# Altium schematic sheet 电源.SchDoc
size A3
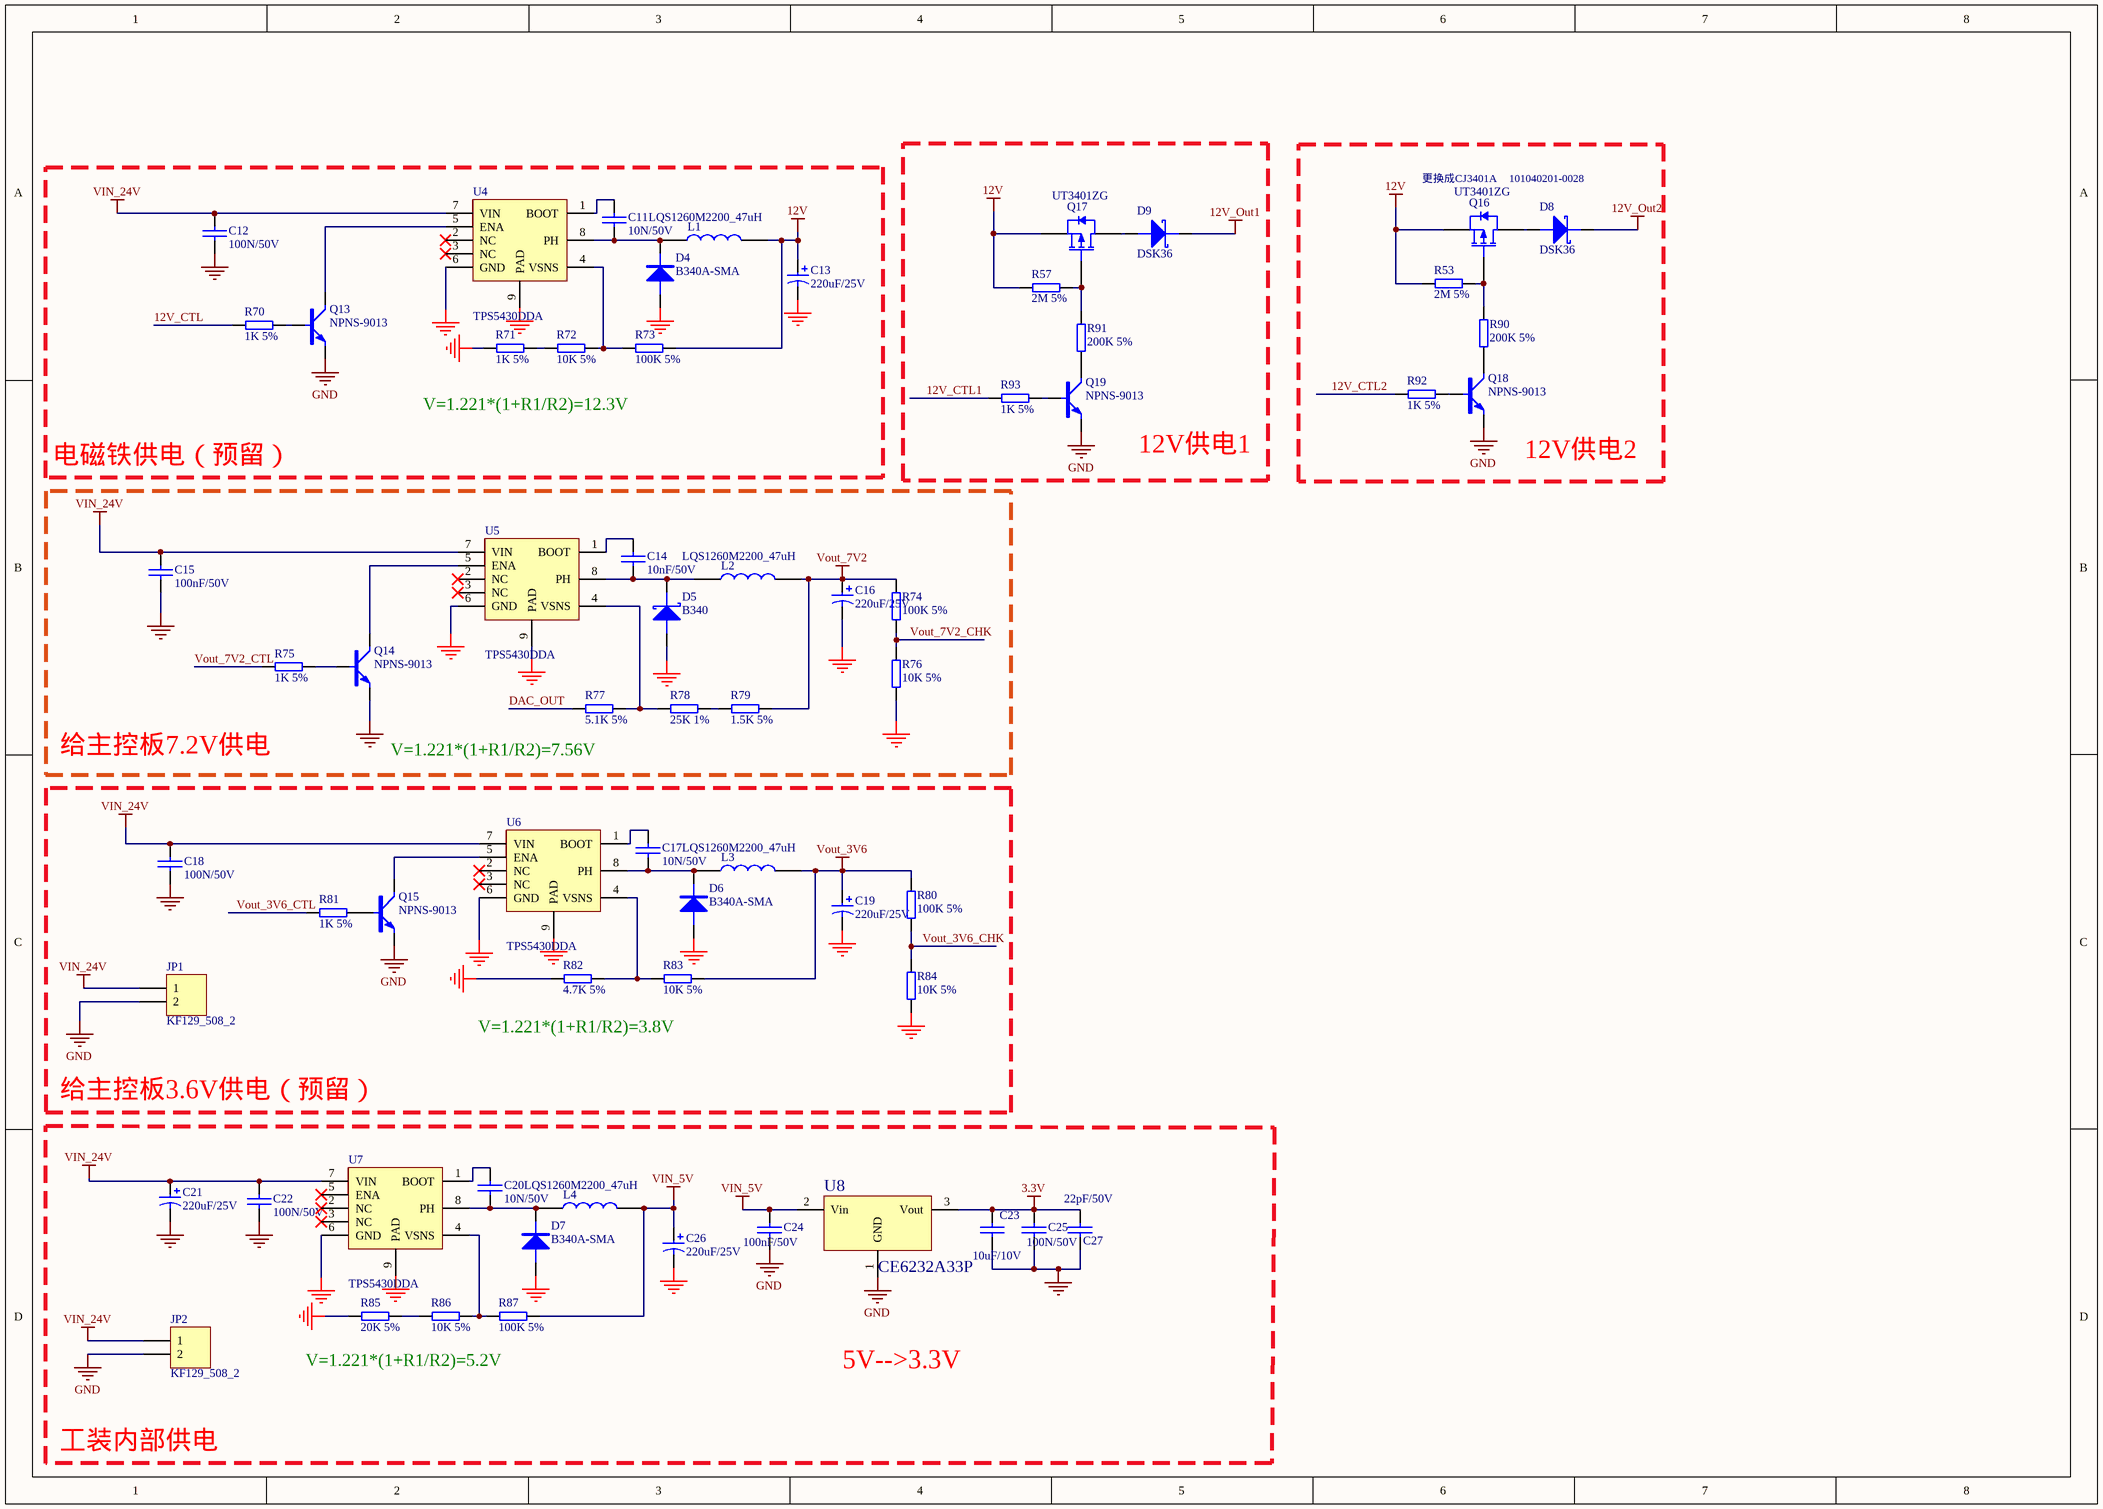
[diagram p0: 电源.SchDoc]

## Parts
C11  10N/50V  [CAP0603]
C12  100N/50V  [CAP0603]
C13  220uF/25V  [220uF 25V]
C14  10nF/50V  [CAP0603]
C15  100nF/50V  [CAP0603]
C16  220uF/25V  [220uF 25V]
C17  10N/50V  [CAP0603]
C18  100N/50V  [CAP0603]
C19  220uF/25V  [220uF 25V]
C20  10N/50V  [CAP0603]
C21  220uF/25V  [220uF 25V]
C22  100N/50V  [CAP0603]
C23  10uF/10V  [CAP0603]
C24  100nF/50V  [CAP0603]
C25  100N/50V  [CAP0603]
C26  220uF/25V  [220uF 25V]
C27  22pF/50V  [CAP0603]
D4  B340A-SMA  [DO-214AC]
D5  B340  [DO-214AC]
D6  B340A-SMA  [DO-214AC]
D7  B340A-SMA  [DO-214AC]
D8  DSK36  [SOD-123FL]
D9  DSK36  [SOD-123FL]
JP1  KF129_508_2  [KF129_508_2]
JP2  KF129_508_2  [KF129_508_2]
L1  LQS1260M2200_47uH  [LQS1212]
L2  LQS1260M2200_47uH  [LQS1212]
L3  LQS1260M2200_47uH  [LQS1212]
L4  LQS1260M2200_47uH  [LQS1212]
Q13  NPNS-9013  [SOT-23]
Q14  NPNS-9013  [SOT-23]
Q15  NPNS-9013  [SOT-23]
Q16  UT3401ZG  [SOT-23]
Q17  UT3401ZG  [SOT-23]
Q18  NPNS-9013  [SOT-23]
Q19  NPNS-9013  [SOT-23]
R53  2M 5%  [RES0603]
R57  2M 5%  [RES0603]
R70  1K 5%  [RES0603]
R71  1K 5%  [RES0603]
R72  10K 5%  [RES0603]
R73  100K 5%  [RES0603]
R74  100K 5%  [RES0603]
R75  1K 5%  [RES0603]
R76  10K 5%  [RES0603]
R77  5.1K 5%  [RES0603]
R78  25K 1%  [RES0603]
R79  1.5K 5%  [RES0603]
R80  100K 5%  [RES0603]
R81  1K 5%  [RES0603]
R82  4.7K 5%  [RES0603]
R83  10K 5%  [RES0603]
R84  10K 5%  [RES0603]
R85  20K 5%  [RES0603]
R86  10K 5%  [RES0603]
R87  100K 5%  [RES0603]
R90  200K 5%  [RES0603]
R91  200K 5%  [RES0603]
R92  1K 5%  [RES0603]
R93  1K 5%  [RES0603]
U4  TPS5430DDA  [SOP-8-P]
U5  TPS5430DDA  [SOP-8-P]
U6  TPS5430DDA  [SOP-8-P]
U7  TPS5430DDA  [SOP-8-P]
U8  CE6232A33P  [SOT-89]

## Blocks framed on the sheet
电磁铁供电（预留）: C11-C13 D4 L1 Q13 R70-R73 U4
12V供电1: D9 Q17 Q19 R57 R91 R93
12V供电2: D8 Q16 Q18 R53 R90 R92
给主控板7.2V供电: C14-C16 D5 L2 Q14 R74-R79 U5
给主控板3.6V供电（预留）: C17-C19 D6 JP1 L3 Q15 R80-R84 U6

## Nets
3.3V: C23.1 C25.1 C27.1 U8.3(Vout)
12V: C13.1 L1.2 Q16.2(S) Q17.2(S) R53.1 R57.1 R73.2
12V_Out1: D9.2
12V_Out2: D8.2
GND: C12.2 C13.2 C15.2 C16.2 C18.2 C19.2 C21.2 C22.2 C23.2 C24.2 C25.2 C26.2 C27.2 D4.1 D5.1 D6.1 D7.1 JP1.2 JP2.2 Q13.2(E) Q14.2(E) Q15.2(E) Q18.2(E) Q19.2(E) R71.1 R76.1 R82.1 R84.1 R85.1 U4.6(GND) U4.9(PAD) U5.6(GND) U5.9(PAD) U6.6(GND) U6.9(PAD) U7.6(GND) U7.9(PAD) U8.1(GND)
VIN_5V: C24.1 C26.1 L4.2 R87.1 U8.2(Vin)
VIN_24V: C12.1 C15.1 C18.1 C21.1 C22.1 JP1.1 JP2.1 U4.7(VIN) U5.7(VIN) U6.7(VIN) U7.7(VIN)
Vout_3V6: C19.1 L3.2 R80.2 R83.2
Vout_7V2: C16.1 L2.2 R74.2 R79.2
12V_CTL: R70.1
12V_CTL1: R93.1
12V_CTL2: R92.1
DAC_OUT: R77.1
Vout_3V6_CHK: R80.1 R84.2
Vout_3V6_CTL: R81.1
Vout_7V2_CHK: R74.1 R76.2
Vout_7V2_CTL: R75.1
NetC11_1: C11.1 D4.2 L1.1 U4.8(PH)
NetC11_2: C11.2 U4.1(BOOT)
NetC14_1: C14.1 D5.2 L2.1 U5.8(PH)
NetC14_2: C14.2 U5.1(BOOT)
NetC17_1: C17.1 D6.2 L3.1 U6.8(PH)
NetC17_2: C17.2 U6.1(BOOT)
NetC20_1: C20.1 D7.2 L4.1 U7.8(PH)
NetC20_2: C20.2 U7.1(BOOT)
NetD8_1: D8.1 Q16.3(D)
NetD9_1: D9.1 Q17.3(D)
NetQ13_1: Q13.1(B) R70.2
NetQ13_3: Q13.3(C) U4.5(ENA)
NetQ14_1: Q14.1(B) R75.2
NetQ14_3: Q14.3(C) U5.5(ENA)
NetQ15_1: Q15.1(B) R81.2
NetQ15_3: Q15.3(C) U6.5(ENA)
NetQ16_1: Q16.1(G) R53.2 R90.2
NetQ17_1: Q17.1(G) R57.2 R91.2
NetQ18_1: Q18.1(B) R92.2
NetQ18_3: Q18.3(C) R90.1
NetQ19_1: Q19.1(B) R93.2
NetQ19_3: Q19.3(C) R91.1
NetR71_2: R71.2 R72.1
NetR72_2: R72.2 R73.1 U4.4(VSNS)
NetR77_2: R77.2 R78.1 U5.4(VSNS)
NetR78_2: R78.2 R79.1
NetR82_2: R82.2 R83.1 U6.4(VSNS)
NetR85_2: R85.2 R86.1
NetR86_2: R86.2 R87.2 U7.4(VSNS)

Not connected (* = marked no-connect by the designer): U4 2(NC)* 3(NC)*; U5 2(NC)* 3(NC)*; U6 2(NC)* 3(NC)*; U7 2(NC)* 3(NC)* 5(ENA)*

## Notes on the sheet
- 更换成CJ3401A    101040201-0028
- V=1.221*(1+R1/R2)=12.3V
- (near R77) V=1.221*(1+R1/R2)=7.56V
- V=1.221*(1+R1/R2)=3.8V
- V=1.221*(1+R1/R2)=5.2V
- 5V-->3.3V
- 工装内部供电

## Library data of the parts
C11 C17 C20 = 101020103-0007: 10N/50V，±10%，0603; Part Name: 0603贴片电容; ID: 35; Part Number: 101020103-0007
C12 C18 C22 C25 = 101020103-0021: 100N/50V，±10%，0603; Part Name: 0603贴片电容; ID: 34; Part Number: 101020103-0021
C13 C16 C19 C21 C26 = 220uF/25V: 220UF,25 V,±20%,8*10mm,立隆电子工业股份有限公司,VEJ221M1ETR-0810; 料号: 1010203-0037
C14 = 101020103-0007: 10nF,50 V,±10%,0603,X7R,国巨,CC0603KRX7R9BB103; Part Name: 0603贴片电容; ID: 6; SMD/DIP: SMD; Part Number: 101020103-0007
C15 C24 = 101020103-0021: 104pF,50 V,±10%,0603,国巨,CC0603KRX7R9BB104; Part Name: 0603贴片电容; ID: 3; SMD/DIP: SMD; Part Number: 101020103-0021
C23 = 101020103-0026: 106pF,10 V,±10%,0603,村田,GRM188R61A106KE47D; Part Name: 0603贴片电容; ID: 8; SMD/DIP: SMD; Part Number: 101020103-0026
C27 = 101020103-0009: 22pF,50 V,±5%,0603,国巨,CC0603JRNPO9BN22; Part Name: 0603贴片电容; ID: 16; SMD/DIP: SMD; Part Number: 101020103-0009
D4 D6 D7 = 101040101-0014: Part Name: 贴片肖特基; ID: 24; Part Number: 101040101-0014
D5 = 101040101-0014: B340,SMA,3 A,0.7 V,28 V,DIODES,B340A-13-F; Part Name: 贴片肖特基; ID: 7; SMD/DIP: SMD; Part Number: 101040101-0014
D8 D9 = 101040101-0043: DSK14,SOD-123FL,1 A,40 V,28 V,台湾强茂集团苏州群鑫电子,DSK14; Part Name: 二极管; ID: 10; SMD/DIP: SMD; Part Number: 101040101-0043
JP1 JP2 = 1010904-0015: KF129-2P,螺丝紧固,2,ABS,松涛; Part Name: 接线端子; ID: 7; SMD/DIP: DIP; Part Number: 1010904-0015
L1-L4 = 1010302-0007: 47uH/2.2A,±20%，0.072Ω，L1200X1200X600; Part Name: 贴片电感; ID: 3; Part Number: 1010302-0007
Q13-Q15 Q18 Q19 = 101040201-0002: 9013,NPN,SOT-23,长电,S9013; Part Name: 贴片三极管; ID: 15; SMD/DIP: SMD; Part Number: 101040201-0002
Q16 Q17 = 101040201-0013: UT3401ZG,P-MOS,SOT-23,UTC,UT3401ZG; Part Name: 功率MOS管; ID: 19; SMD/DIP: SMD; Part Number: 101040201-0013
R53 R57 = 101010103-0025: 国巨,±5%,0603,,155 ℃,-55 ℃,RC0603JR-072ML,含铅,100 ppm/℃,1/10W,,2M; Part Name: 0603贴片电阻; ID: 20; SMD/DIP: SMD; Part Number: 101010103-0025
R70 R71 R75 R81 R92 R93 = 101010103-0008: 1K,±5%,1/10W,0603,国巨,RC0603JR-071KL; Part Name: 0603贴片电阻; ID: 10; SMD/DIP: SMD; Part Number: 101010103-0008
R72 R76 R83 R84 R86 = 101010103-0003: 国巨,±5%,0603,,155 ℃,-55 ℃,RC0603JR-0710KL,无铅,200 ppm/℃,1/10W,,10K; Part Name: 0603贴片电阻; ID: 7; SMD/DIP: SMD; Part Number: 101010103-0003
R73 R74 = 101010103-0005: 国巨,±5%,0603,,155 ℃,-55 ℃,RC0603JR-07100KL,无铅,100 ppm/℃,1/10W,,100K; Part Name: 0603贴片电阻; ID: 3; SMD/DIP: SMD; Part Number: 101010103-0005
R77 = 101010103-0015: 国巨,±5%,0603,,155 ℃,55 ℃,RC0603JR-075.1KL,无铅,200 ppm/℃,1/10W,,5.1k; Part Name: 0603贴片电阻; ID: 27; SMD/DIP: SMD; Part Number: 101010103-0015
R78 = 101010103-056: 25K±1%,1/10W,0603; Part Number: 101010103-0056; Part Name: 0603贴片电阻; ID: 10; SMD/DIP: SMD
R79 = 101010103-0013: 1.5K,±5%,1/10W,0603,国巨,RC0603JR-071K5L; Part Name: 0603贴片电阻; ID: 10; SMD/DIP: SMD; Part Number: 101010103-0013
R80 R87 = 101010103-0005: 100K±5%,1/10W,0603; Part Name: 0603贴片电阻; ID: 30; Part Number: 101010103-0005
R82 = 101010103-0042: 4.7K±5%,1/10W,0603; Part Name: 0603贴片电阻; ID: 24; SMD/DIP: SMD; Part Number: 101010103-0042
R85 = 101010103-0004: 国巨,±5%,0603,,155 ℃,-55 ℃,RC0603JR-0720KL,无铅,200 ppm/℃,1/10W,,20K; Part Name: 0603贴片电阻; ID: 15; SMD/DIP: SMD; Part Number: 101010103-0004
R90 R91 = 101010103-0034: 200K,±5%,1/10W,0603,国巨,RC0603JR-07200KL; Part Name: 0603贴片电阻; ID: 13; SMD/DIP: SMD; Part Number: 101010103-0034
U4-U7 = 101050101-0053: TPS5430DDA,SOP8,TI,TPS5430DDA; Part Name: 电源芯片; ID: 9; SMD/DIP: SMD; Part Number: 101050101-0053
U8 = 1010503-0029: CE6232-3.3,CE6232-3.3,SOT89-3,8V,1.8V,0.11V,3.3V,300mA,0.8uA,南京芯力微电子有限公司; Part Name: 线性稳压芯片; ID: 5; SMD/DIP: SMD; Part Number: 1010503-0029